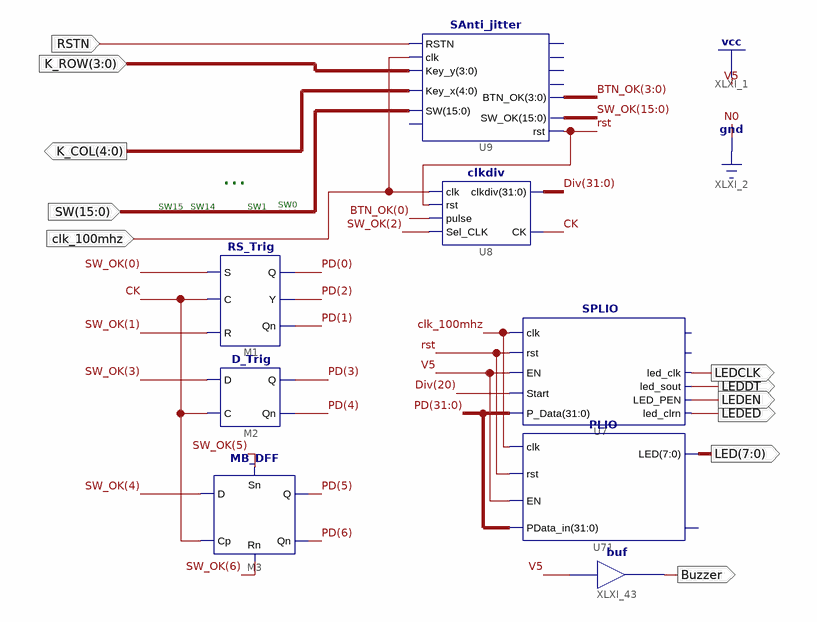
[diagram p0: schematic sheet 1]
// Xilinx ISE schematic Exp10_Trigger.sch (kintex7) as structural Verilog: 8 symbols, 11 ports
module Exp10_Trigger (
  input  [15:0] SW,
  input  [3:0] K_ROW,
  input  RSTN,
  input  clk_100mhz,
  output [4:0] K_COL,
  output LEDCLK,
  output LEDDT,
  output LEDEN,
  output LEDED,
  output [7:0] LED,
  output Buzzer
);

  wire CK, rst;
  wire [3:0] BTN_OK;
  wire [15:0] SW_OK;
  wire [31:0] Div, PD;

  SAnti_jitter U9 (
    .SW(SW), .Key_y(K_ROW), .Key_x(K_COL), .RSTN(RSTN), .clk(clk_100mhz), .rst(rst), .SW_OK(SW_OK),
    .BTN_OK(BTN_OK));  // open: readn, Key_out, Key_ready, CR, pulse_out
  RS_Trig M1 (.C(CK), .R(SW_OK[1]), .S(SW_OK[0]), .Qn(PD[1]), .Q(PD[0]), .Y(PD[2]));
  MB_DFF M3 (.Cp(CK), .D(SW_OK[4]), .Qn(PD[6]), .Q(PD[5]), .Sn(SW_OK[5]), .Rn(SW_OK[6]));
  D_Trig M2 (.Qn(PD[4]), .D(SW_OK[3]), .C(CK), .Q(PD[3]));
  clkdiv U8 (.Sel_CLK(SW_OK[2]), .clk(clk_100mhz), .rst(rst), .pulse(BTN_OK[0]), .CK(CK), .clkdiv(Div));
  SPLIO U7 (
    .clk(clk_100mhz), .P_Data(PD), .rst(rst), .EN(1'b1), .Start(Div[20]), .led_clk(LEDCLK), .led_clrn(LEDED),
    .LED_PEN(LEDEN), .led_sout(LEDDT));  // open: LED, GPIOf0
  PLIO U71 (.clk(clk_100mhz), .rst(rst), .EN(1'b1), .PData_in(PD), .LED(LED));  // open: GPIOf0
  buf XLXI_43 (Buzzer, 1'b1);

  // Notes on the sheet:
  //   ...
  //   SW0
  //   SW15
  //   SW14
  //   SW1
  //   LOC on signal SW(15:0) = K13,K14,J13,J14,H13,H14,G12,F12
  //   LOC on signal clk_100mhz = t9
endmodule
